# Altium schematic sheet PROTECTION&SupplySwitching.SchDoc
size A4; SheetNumber: 13; SheetTotal: 14
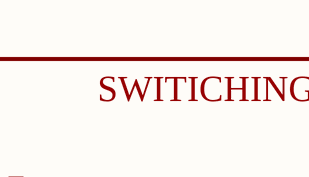
[diagram p0: PROTECTION&SupplySwitching.SchDoc, top left]
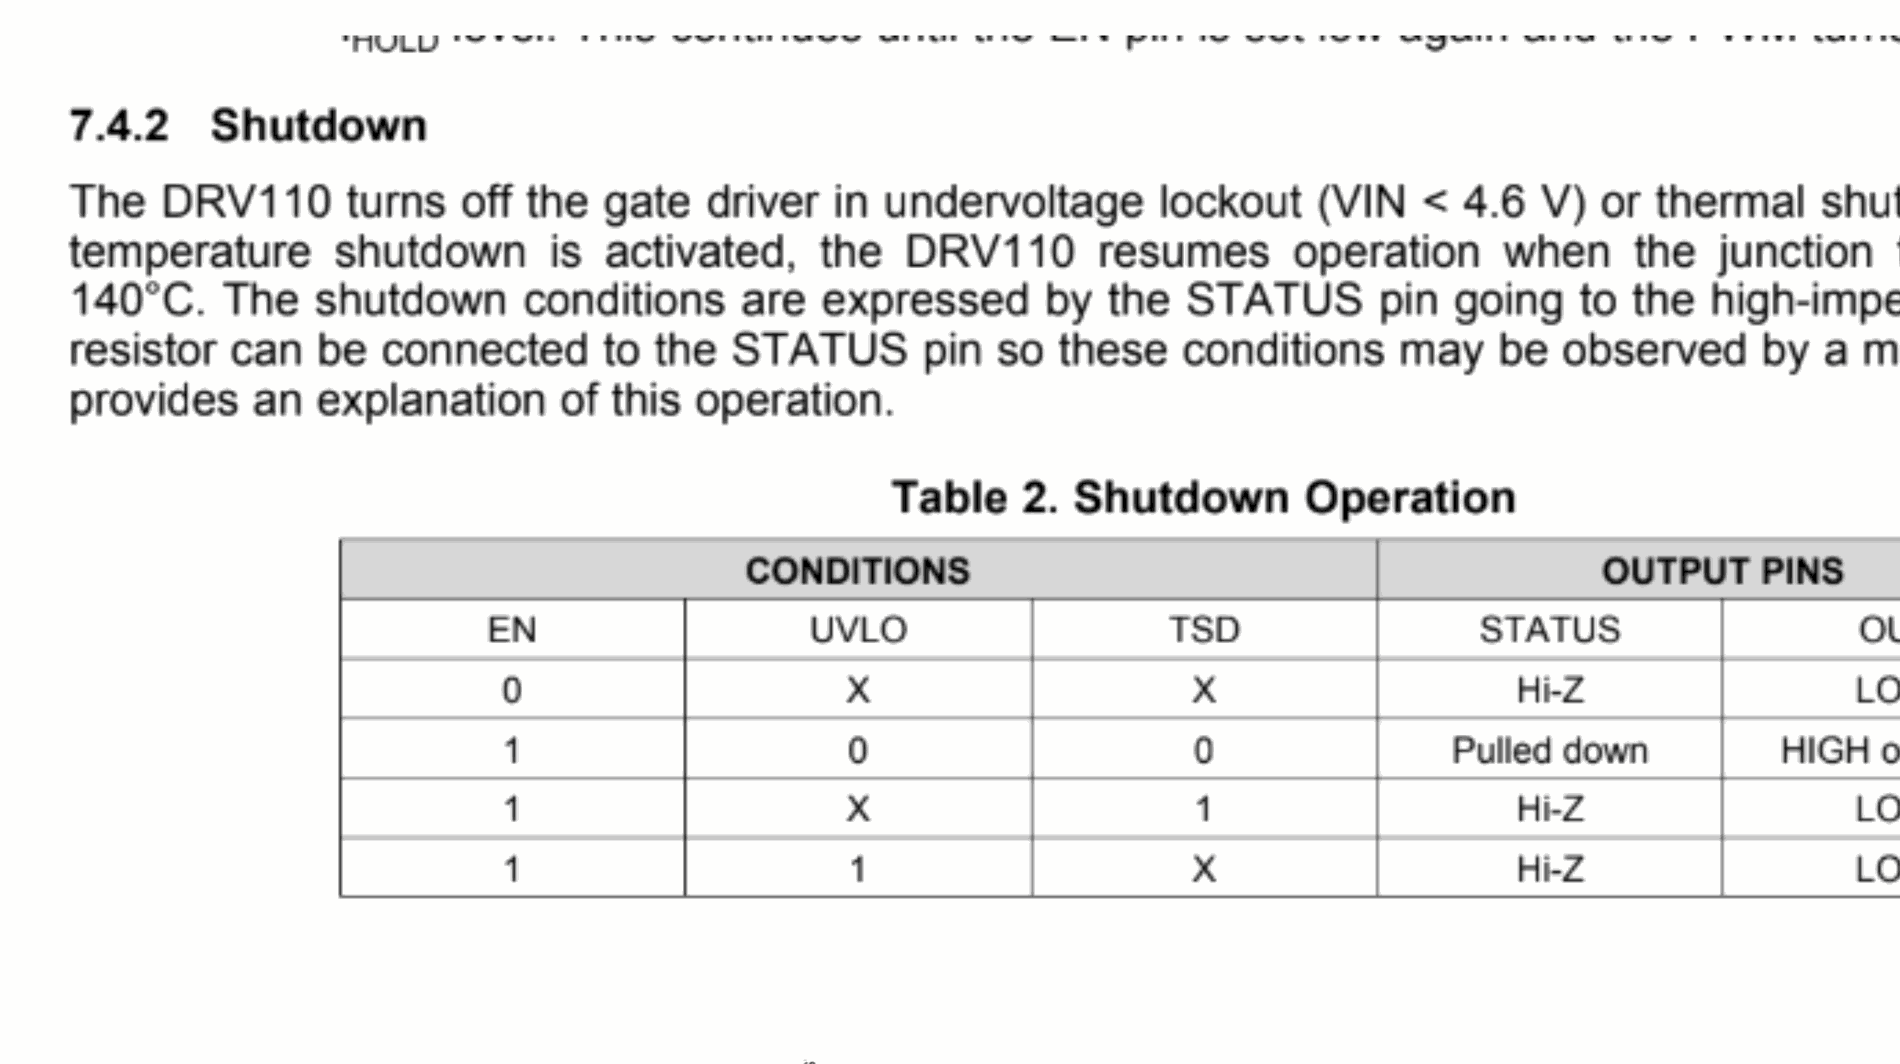
[diagram p1: PROTECTION&SupplySwitching.SchDoc, top middle]
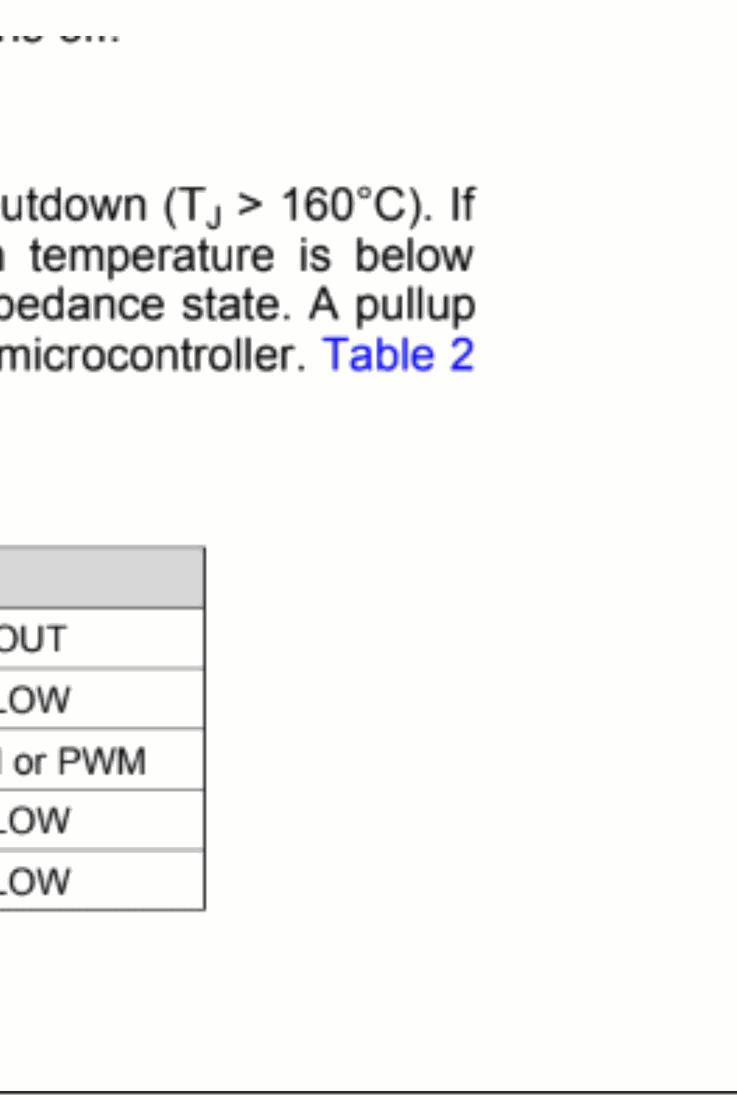
[diagram p2: PROTECTION&SupplySwitching.SchDoc, top right]
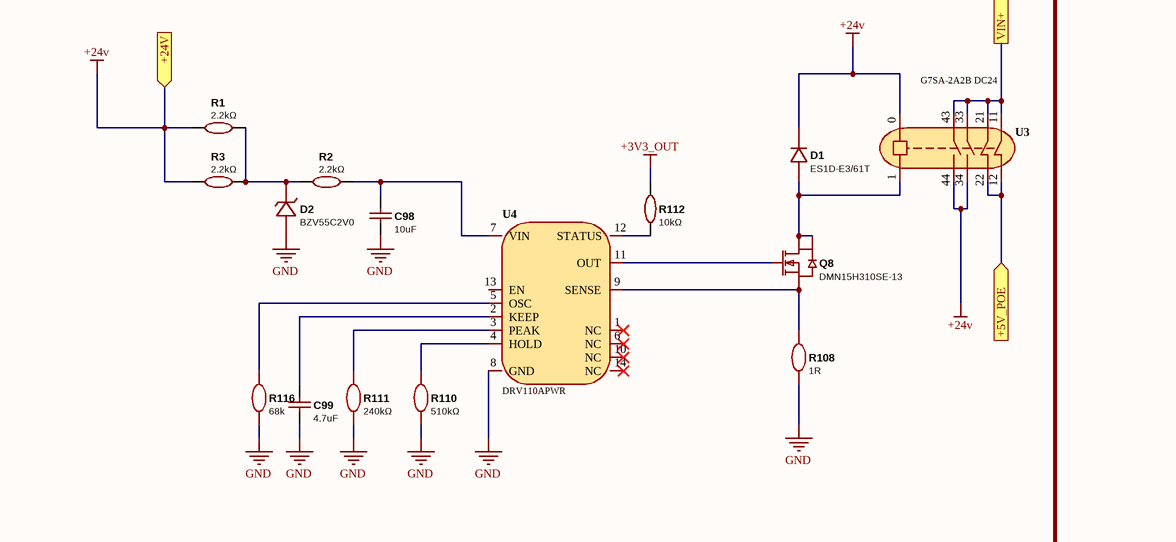
[diagram p3: PROTECTION&SupplySwitching.SchDoc, bottom left]
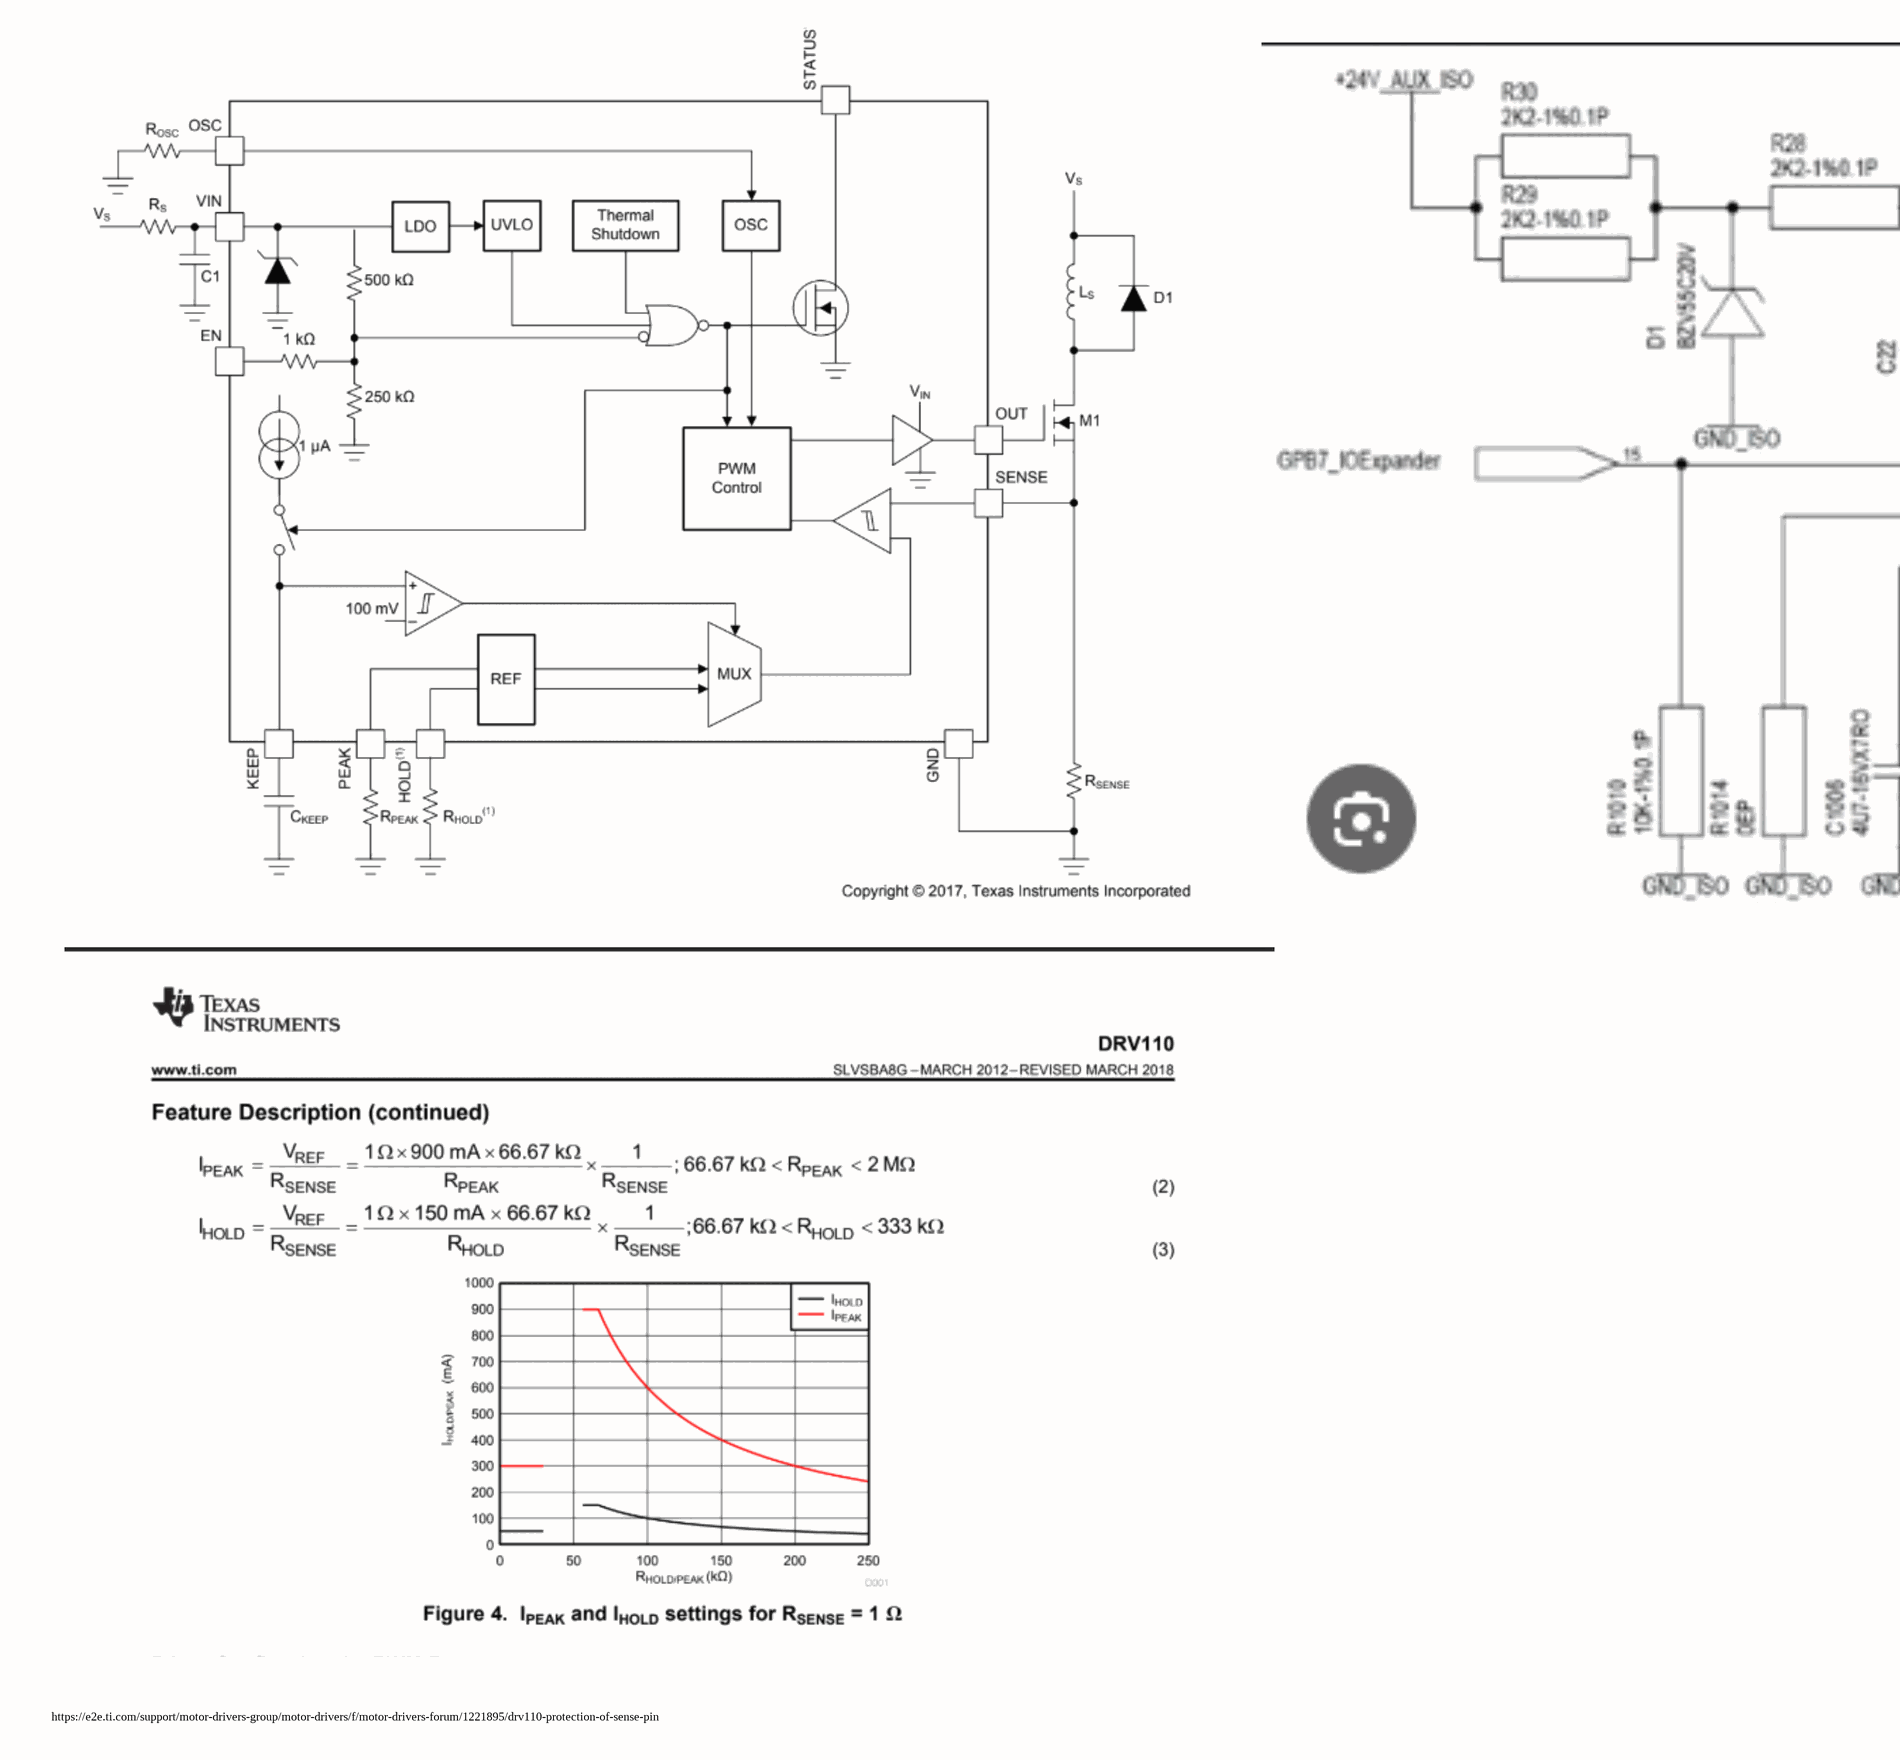
[diagram p4: PROTECTION&SupplySwitching.SchDoc, bottom middle]
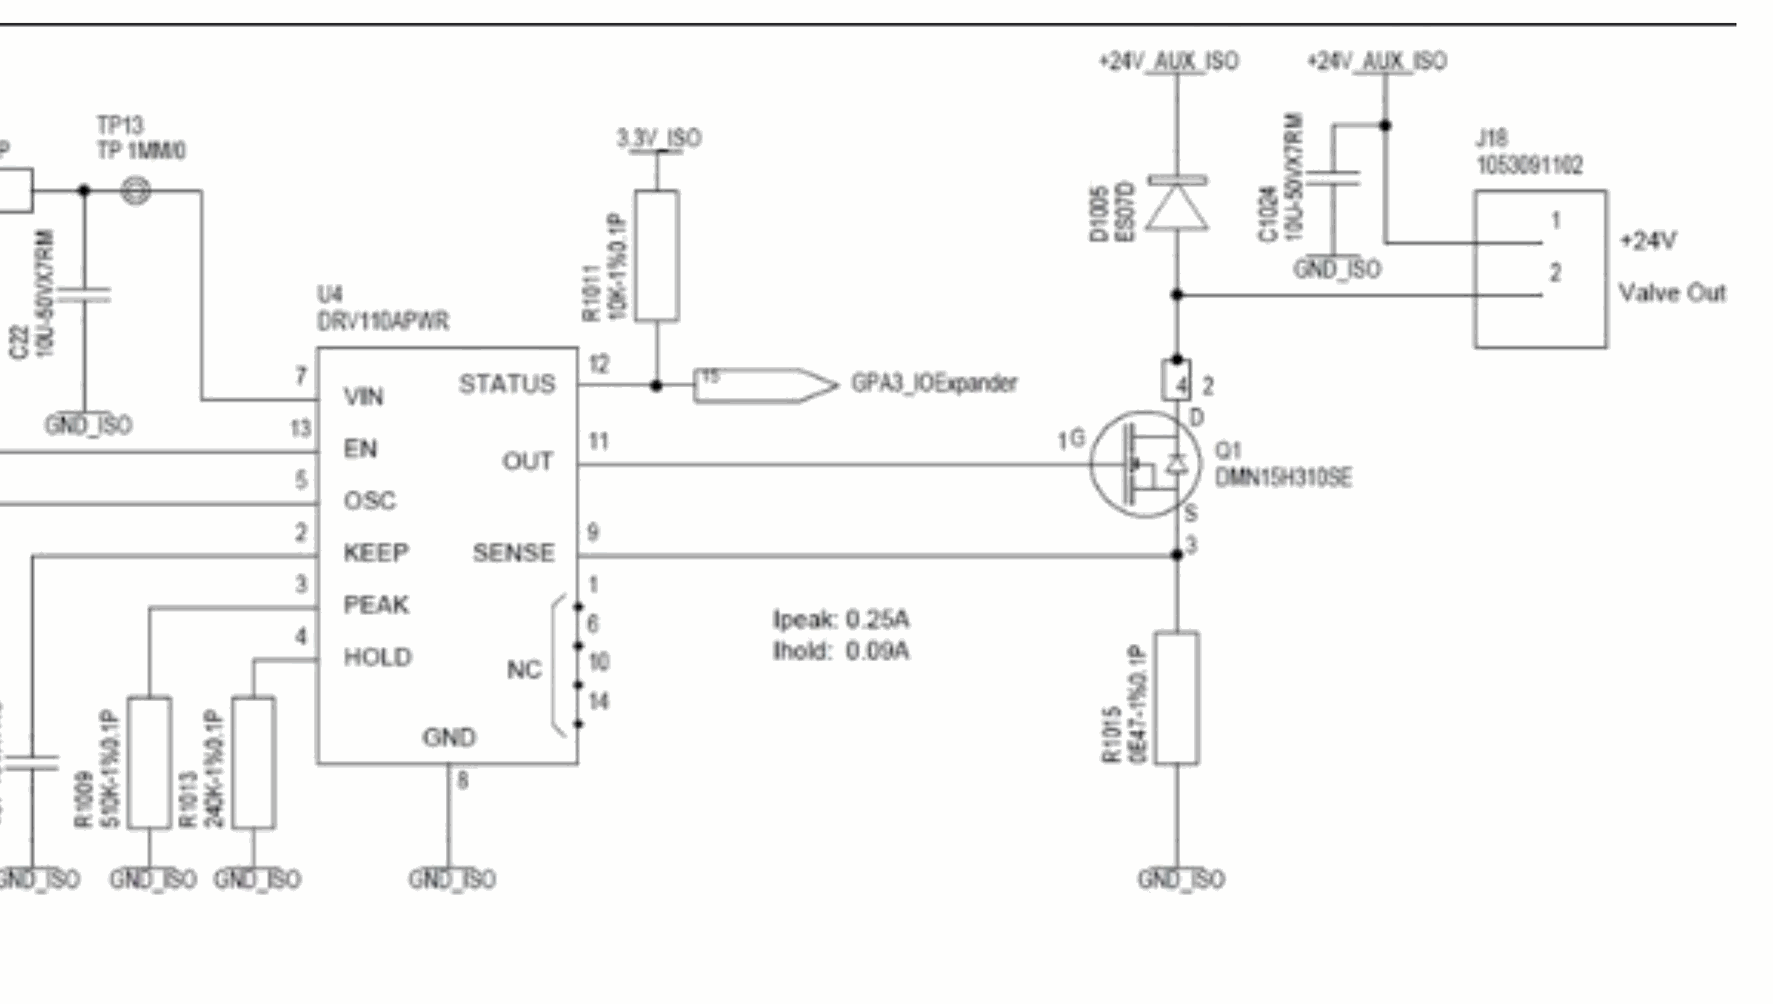
[diagram p5: PROTECTION&SupplySwitching.SchDoc, bottom right]

## Parts
C98  10uF  [C_1206]
C99  4.7uF  [C_1206]
D1  ES1D-E3/61T  [SMA_L4.3-W2.6-LS5.2-RD]
D2  BZV55C2V0  [SOD-80_L3.5-W1.5-RD]
Q8  DMN15H310SE-13  [SOT-223-3_L6.5-W3.4-P2.30-LS7.0-BR]
R1  2.2kΩ  [R_0805]
R2  2.2kΩ  [R_0805]
R3  2.2kΩ  [R_0805]
R108  1R  [R_1206]
R110  510kΩ  [R_0805]
R111  240kΩ  [R_0805]
R112  10kΩ  [R_0805]
R116  68k  [R_0805]
U3  G7SA-2A2B DC24  [RELAY-TH_G7SA-2A2B]
U4  DRV110APWR  [TSSOP-14_L5.0-W4.4-P0.65-LS6.4-BL]

## Blocks framed on the sheet
SWITICHING SUPPLY: C98 C99 D1 D2 Q8 R1-R3 R108 R110-R112 R116 U3 U4

## Ports
+5V_POE (in), +24V (in), VIN+ (out)

## Nets
+3V3_OUT: R112.2
+24v: D1.1(C) R1.1 R3.1 U3.0 U3.34 U3.44 ; port +24V
GND: C98.1 C99.1 D2.2(A) R108.1 R110.1 R111.1 R116.1 U4.8(GND)
+5V_POE: U3.12 U3.22 ; port +5V_POE
VIN+: U3.11 U3.21 U3.33 U3.43 ; port VIN+
NetC98_2: C98.2 R2.2 U4.7(VIN)
NetC99_2: C99.2 U4.2(KEEP)
NetD1_2: D1.2(A) Q8.2(D) Q8.4(D) U3.1
NetD2_1: D2.1(K) R1.2 R2.1 R3.2
NetQ8_1: Q8.1(G) U4.11(OUT)
NetQ8_3: Q8.3(S) R108.2 U4.9(SENSE)
NetR110_2: R110.2 U4.4(HOLD)
NetR111_2: R111.2 U4.3(PEAK)
NetR112_1: R112.1 U4.12(STATUS)
NetR116_2: R116.2 U4.5(OSC)

Not connected (* = marked no-connect by the designer): U4 1(NC)* 6(NC)* 10(NC)* 13(EN) 14(NC)*

## Notes on the sheet
- https://e2e.ti.com/support/motor-drivers-group/motor-drivers/f/motor-drivers-forum/1221895/drv110-protection-of-sense-pin
- Project Name:
- Size:
- Date:
- A4
- Version:
- Time:
- V1.4.0.0
- Sheet:
- Of
- File:

## Library data of the parts
C98 = 10uF: Manufacturer Part: CL31A106KBHNNNE; Manufacturer: SAMSUNG(三星); nameAlias: Value; Supplier: LCSC; Supplier Part: C13585; JLCPCB Part Class: Basic Part; spicePre: C; spiceSymbolName: CL31A106KBHNNNE
C99 = 4.7uF: Manufacturer Part: CL31B475KBHNNNE; Manufacturer: SAMSUNG(三星); nameAlias: Value; Supplier: LCSC; Supplier Part: C51205; JLCPCB Part Class: Extended Part; spicePre: C; spiceSymbolName: CL31B475KBHNNNE
D1 = ES1D-E3/61T: Manufacturer: VISHAY(威世); Supplier: LCSC; Manufacturer Part: ES1D-E3/61T; Supplier Part: C82648; JLCPCB Part Class: Extended Part; spicePre: D; spiceSymbolName: ES1D-E3/61T
D2 = BZV55C2V0: Manufacturer: LGE(鲁光); Contributor: LCSC; Supplier: LCSC; Supplier Part: C545321; Manufacturer Part: BZV55C2V0; JLCPCB Part Class: Extended Part; spicePre: D; spiceSymbolName: BZV55C2V0
Q8 = DMN15H310SE-13: Manufacturer: DIODES(美台); Contributor: LCSC; Supplier: LCSC; Supplier Part: C155224; Manufacturer Part: DMN15H310SE-13; JLCPCB Part Class: Extended Part; spicePre: Q; spiceSymbolName: DMN15H310SE-13
R1-R3 = 2.2kΩ: Manufacturer: YAGEO(国巨); Manufacturer Part: RC0805FR-072K2L; nameAlias: Value; Supplier: LCSC; Supplier Part: C114561; JLCPCB Part Class: Extended Part; spicePre: R; spiceSymbolName: RC0805FR-072K2L
R108 = 0.47R: Manufacturer Part: RC1206FR-071RL; Manufacturer: YAGEO; nameAlias: Value(Ω); Contributor: LCEDA_Lib; Supplier Part: C137355; spicePre: R; spiceSymbolName: R_0603_EU
R110 = 510kΩ: Manufacturer: YAGEO(国巨); Manufacturer Part: RT0805BRB07510KL; nameAlias: Value; Contributor: lcsc; Supplier: LCSC; Supplier Part: C864415; JLCPCB Part Class: Extended Part; spicePre: R; spiceSymbolName: RT0805BRB07510KL
R111 = 240kΩ: Manufacturer: YAGEO(国巨); Manufacturer Part: RT0805BRD07240KL; nameAlias: Value; Contributor: lcsc; Supplier: LCSC; Supplier Part: C784586; JLCPCB Part Class: Extended Part; spicePre: R; spiceSymbolName: RT0805BRD07240KL
R112 = 10kΩ: Manufacturer: YAGEO(国巨); Manufacturer Part: RT0805BRD0710KL; nameAlias: Value; Supplier: LCSC; Supplier Part: C110775; JLCPCB Part Class: Extended Part; spicePre: R; spiceSymbolName: RT0805BRD0710KL
R116 = 240kΩ: Manufacturer: YAGEO; Manufacturer Part: RC0805FR-0768KL; nameAlias: Value; Contributor: lcsc; Supplier: LCSC; Supplier Part: C114548; JLCPCB Part Class: Extended Part; spicePre: R; spiceSymbolName: RC0805FR-0768KL
U3 = G7SA-2A2B DC24: Manufacturer: OMRON(欧姆龙); Add into BOM: yes; Symbol: G7SA-2A2B DC24; Device: G7SA-2A2B DC24; LCSC Part Name: G7SA-2A2B DC24; Supplier Part: C397126; Manufacturer Part: G7SA-2A2B DC24; Supplier Footprint: DIP,13x40mm; JLCPCB Part Class: Extended Part; Datasheet: https://item.szlcsc.com/datasheet/G7SA-2A2B%2520DC24/378713.html; Supplier: LCSC; Convert to PCB: yes; Coil Voltage: -; Contact Form: -; Number of Pins: -; Contact Rating: -; Switching Voltage(Max): -; Contact Material: -; Coil Resistance: -; Switching Current(Max): -; Operate Time: -; Release Time: -; Coil Type: -; Contact Resistance: -; Operating Temperature: -
U4 = DRV110APWR: Manufacturer: TI(德州仪器); Add into BOM: yes; Symbol: DRV110APWR; Device: DRV110APWR; LCSC Part Name: 330mA 15V电机驱动芯片; Supplier Part: C2653796; Manufacturer Part: DRV110APWR; Supplier Footprint: TSSOP-14; JLCPCB Part Class: Extended Part; Datasheet: https://www.ti.com/cn/lit/gpn/drv110; Supplier: LCSC; Convert to PCB: yes